# EAGLE schematic key_default_btm_wider (EAGLE 6.4)
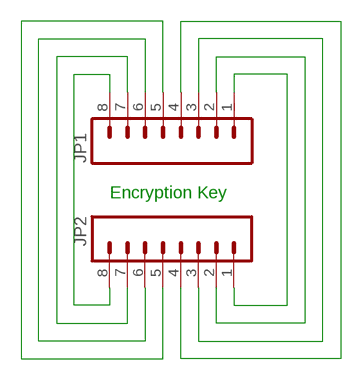
[diagram p0: schematic, sheet 1]

## Parts
JP1  M08LOCK  [1X08_LOCK]
JP2  M08LOCK  [1X08_LOCK]

## Nets
N$3: JP1.8 JP2.8
N$4: JP1.7 JP2.7
N$5: JP1.6 JP2.6
N$6: JP1.5 JP2.5
N$7: JP1.4 JP2.4
N$8: JP1.3 JP2.3
N$9: JP1.2 JP2.2
N$10: JP1.1 JP2.1

## Notes on the sheet
- Encryption Key

## Library data of the parts
JP1 JP2 = SparkFun-Connectors:M08: Header 8 Standard 8-pin 0.1" header. Use with straight break away headers (SKU : PRT-00116), right angle break away headers (PRT-00553), swiss pins (PRT-00743), machine pins (PRT-00117), and female headers (PRT-00115).